# Altium schematic sheet solder_pen.SchDoc
size A4; SheetNumber: 5; SheetTotal: 5; SPICEModelCacheUOHFEEZY: <root> / <DocumentId>UOHFEEZY</DocumentId> / </root>
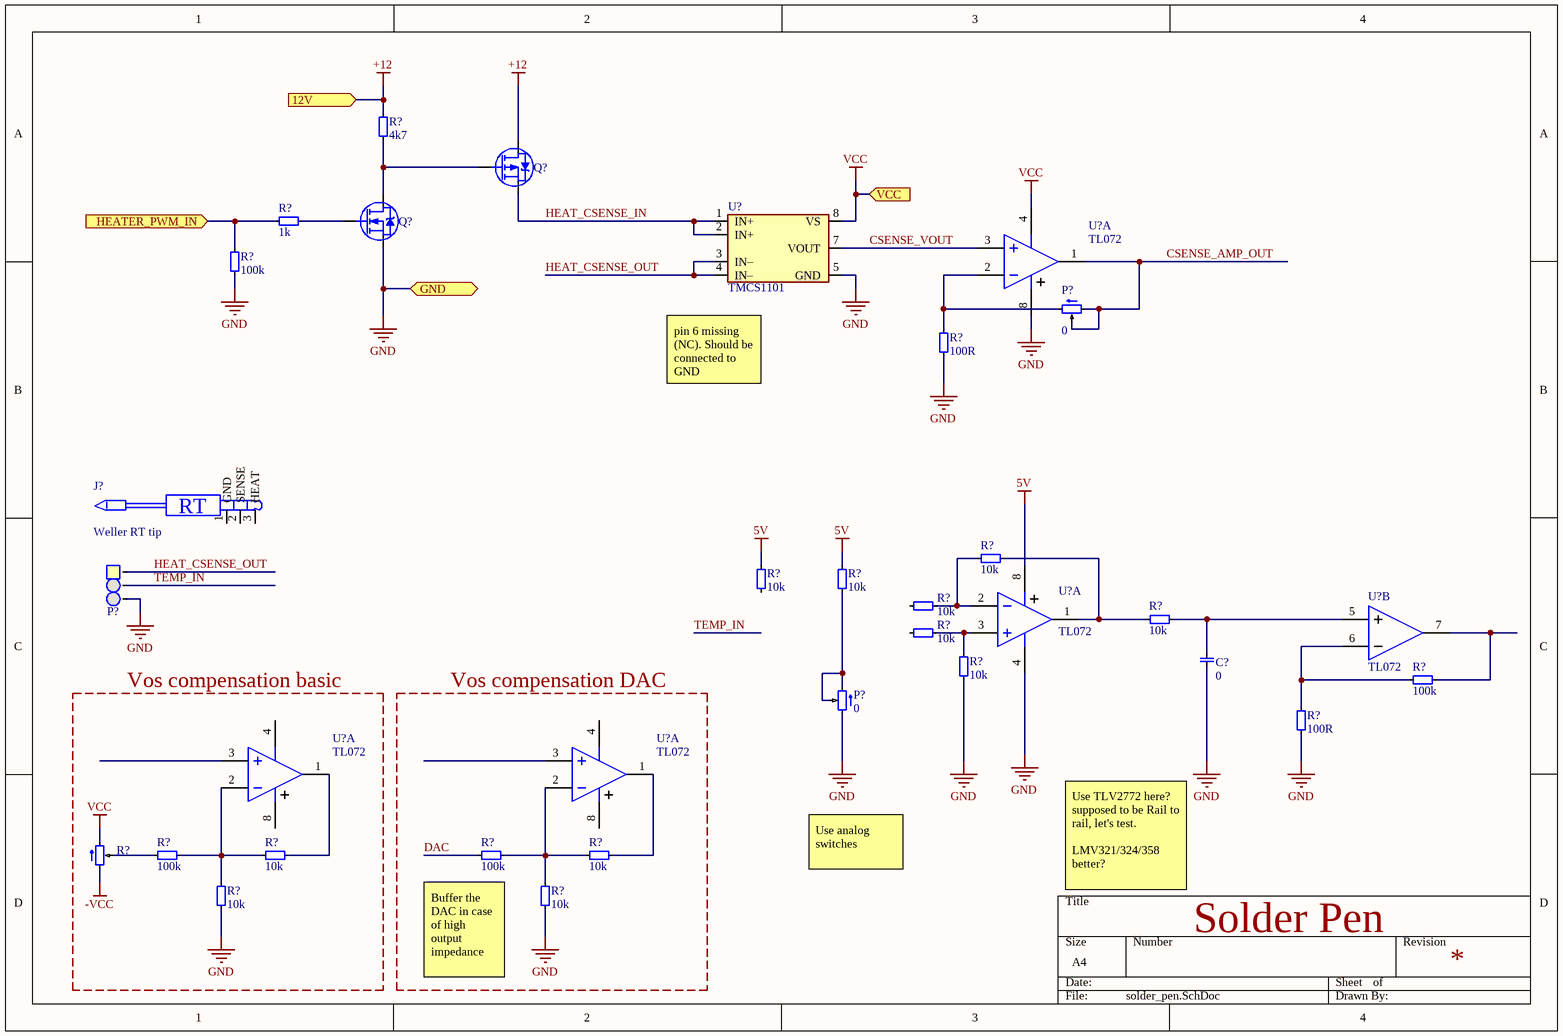
[diagram p0: solder_pen.SchDoc]

## Parts
(Parts that share a designator on the sheet are numbered #1, #2 ... from top to bottom, then left to right.)
C?  value 0  [0603 cap]  (hidden comment: 0603, capacitor)
J?  Weller RT tip
P?#1  value 0  [PV36W104C01B00]  (hidden comment: Pot)
P?#2  1x3 Pin Header  [padThree_L]  (value not drawn)
P?#3  value 0  [PV36W104C01B00]  (hidden comment: Pot)
Q?#1  IRF4905  [d2pak]  (value not drawn)
Q?#2  IRF640  [TO-220]  (value not drawn)
R?#1  value 4k7  [0603]  (hidden comment: 0603, resistor)
R?#2  value 1k  [0603]  (hidden comment: 0603, resistor)
R?#3  value 100k  [0603]  (hidden comment: 0603, resistor)
R?#4  value 100R  [0603]  (hidden comment: 0603, resistor)
R?#5  value 10k  [0603]  (hidden comment: 0603, resistor)
R?#6  value 10k  [0603]  (hidden comment: 0603, resistor)
R?#7  value 10k  [0603]  (hidden comment: 0603, resistor)
R?#8  value 10k  [0603]  (hidden comment: 0603, resistor)
R?#9  value 10k  [0603]  (hidden comment: 0603, resistor)
R?#10  value 10k  [0603]  (hidden comment: 0603, resistor)
R?#11  value 10k  [0603]  (hidden comment: 0603, resistor)
R?#12  value 100k  [0603]  (hidden comment: 0603, resistor)
R?#13  value 100R  [0603]  (hidden comment: 0603, resistor)
R?#14  Potentiometer  [P110KH1]  (value not drawn)
R?#15  value 100k  [0603]  (hidden comment: 0603, resistor)
R?#16  value 10k  [0603]  (hidden comment: 0603, resistor)
R?#17  value 100k  [0603]  (hidden comment: 0603, resistor)
R?#18  value 10k  [0603]  (hidden comment: 0603, resistor)
R?#19  value 10k  [0603]  (hidden comment: 0603, resistor)
R?#20  value 10k  [0603]  (hidden comment: 0603, resistor)
U?#1  TMCS1101  [SOIC8]
U?#2  TL072  [SOIC8]  (part A of 2)
U?#3  TL072  [SOIC8]  (part A of 2)
U?#4  TL072  [SOIC8]  (part B of 2)
U?#5  TL072  [SOIC8]  (part A of 2)
U?#6  TL072  [SOIC8]  (part A of 2)

## Blocks framed on the sheet
Vos compensation basic: R?#14-R?#16 R?#19 U?#5
Vos compensation DAC: R?#17 R?#18 R?#20 U?#6

## Ports
12V (in), GND (bidir), HEATER_PWM_IN (in), VCC (in)

## Nets
5V: R?#6.0 R?#7.0 U?#3.8(V+)
+12: Q?#1.2(D) R?#1.0 ; port 12V
-VCC: R?#14.1
GND: C?.0 P?#2.3 P?#3.1 Q?#2.3(S) R?#3.1 R?#4.1 R?#11.1 R?#13.1 R?#19.1 R?#20.1 U?#1.5(GND) U?#2.8(V+) U?#3.4(V-) ; port GND
VCC: R?#14.3 U?#1.8(VS) U?#2.4(V-) ; port VCC
CSENSE_AMP_OUT: P?#1.1 P?#1.2 U?#2.1(OUT1)
CSENSE_VOUT: U?#1.7(VOUT) U?#2.3(IN+)
DAC: R?#17.0
HEAT_CSENSE_IN: Q?#1.3(S) U?#1.1(IN+) U?#1.2(IN+)
HEAT_CSENSE_OUT: P?#2.1 U?#1.3(IN–) U?#1.4(IN–)
HEATER_PWM_IN: R?#2.1 R?#3.0 ; port HEATER_PWM_IN
TEMP_IN: P?#2.2
NetC?_1: C?.1 R?#9.0 U?#4.5(IN+)
NetP?#1_3: P?#1.3 R?#4.0 U?#2.2(IN-)
NetP?#3_2: P?#3.2 P?#3.3 R?#7.1
NetQ?#1_1: Q?#1.1(G) Q?#2.2(D) R?#1.1
NetQ?#2_1: Q?#2.1(G) R?#2.0
NetR?#5_0: R?#5.0 R?#9.1 U?#3.1(OUT1)
NetR?#5_1: R?#5.1 R?#8.0 U?#3.2(IN-)
NetR?#10_0: R?#10.0 R?#11.0 U?#3.3(IN+)
NetR?#12_0: R?#12.0 U?#4.7(OUT2)
NetR?#12_1: R?#12.1 R?#13.0 U?#4.6(IN-)
NetR?#14_2: R?#14.2 R?#15.0
NetR?#15_1: R?#15.1 R?#16.0 R?#19.0 U?#5.2(IN-)
NetR?#16_1: R?#16.1 U?#5.1(OUT1)
NetR?#17_1: R?#17.1 R?#18.0 R?#20.0 U?#6.2(IN-)
NetR?#18_1: R?#18.1 U?#6.1(OUT1)

Not connected (* = marked no-connect by the designer): J? 1(GND) 2(SENSE) 3(HEAT); R?#6 1; R?#8 1; R?#10 1; U?#5 3(IN+) 4(V-) 8(V+); U?#6 3(IN+) 4(V-) 8(V+)

## Notes on the sheet
- (near U?#1) pin 6 missing (NC). Should be connected to GND
- Use analog switches
- Use TLV2772 here? supposed to be Rail to rail, let's test.
  LMV321/324/358 better?
- (near R?#17) Buffer the DAC in case of high output impedance
- Solder Pen
- (in symbol Weller RT tip) RT

## Library data of the parts
P?#2 = 1x3 Pin Header: 2.54 mm; Value: 1x3 Pin Header
Q?#1 = IRF4905: P-Channel HEXFET® Power MOSFET
Q?#2 = IRF640: N-channel Power MOSFET; Value: N Channel MOSFET; Farnell: ETF! , 8648298
R?#14 = Potentiometer: Value: 0; ELFA: 300-08-353
U?#1 = TMCS1101: Hall-Effect Current Sensor
U?#2-U?#6 = TL072: Dual FET-Input Operational Amplifier
C? = 0603, capacitor: Order number: *